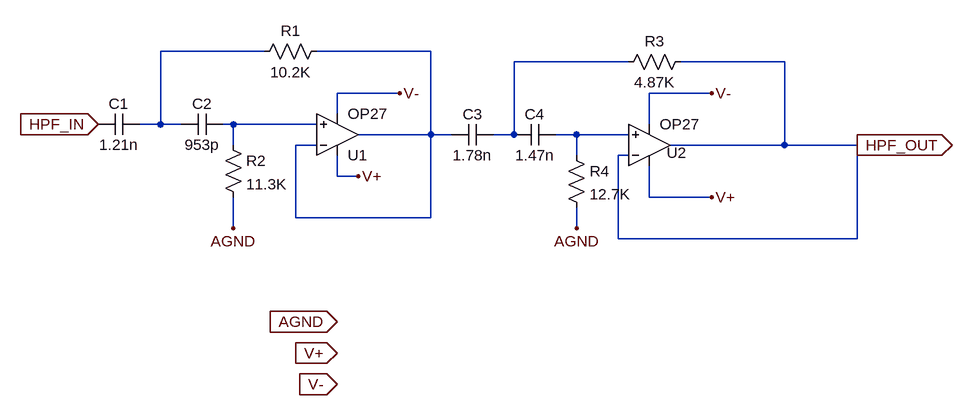
[diagram p0: schematic Acoustics_HPF.asc]
Acoustics_HPF.asc, the LTspice schematic file:
Version 4
SHEET 1 1304 788
WIRE 224 -32 64 -32
WIRE 480 -32 304 -32
WIRE 784 -16 608 -16
WIRE 1024 -16 864 -16
WIRE 432 32 336 32
WIRE 912 32 816 32
WIRE 336 64 336 32
WIRE 64 80 64 -32
WIRE 64 80 32 80
WIRE 96 80 64 80
WIRE 176 80 160 80
WIRE 304 80 176 80
WIRE 816 80 816 32
WIRE 480 96 480 -32
WIRE 480 96 368 96
WIRE 512 96 480 96
WIRE 608 96 608 -16
WIRE 608 96 576 96
WIRE 704 96 672 96
WIRE 784 96 704 96
WIRE 176 112 176 80
WIRE 304 112 272 112
WIRE 1024 112 1024 -16
WIRE 1024 112 848 112
WIRE 1136 112 1024 112
WIRE 704 128 704 96
WIRE 784 128 768 128
WIRE 336 160 336 128
WIRE 368 160 336 160
WIRE 816 192 816 144
WIRE 912 192 816 192
WIRE 272 224 272 112
WIRE 480 224 480 96
WIRE 480 224 272 224
WIRE 176 240 176 192
WIRE 704 240 704 208
WIRE 768 256 768 128
WIRE 1136 256 1136 112
WIRE 1136 256 768 256
FLAG 1136 112 HPF_OUT
IOPIN 1136 112 Out
FLAG 912 192 V+
FLAG 704 240 AGND
FLAG 176 240 AGND
FLAG 368 160 V+
FLAG 912 32 V-
FLAG 432 32 V-
FLAG -32 80 HPF_IN
IOPIN -32 80 In
FLAG 336 384 AGND
IOPIN 336 384 In
FLAG 336 432 V+
IOPIN 336 432 In
FLAG 336 480 V-
IOPIN 336 480 In
SYMBOL cap 32 64 R90
WINDOW 0 0 32 VBottom 2
WINDOW 3 32 32 VTop 2
SYMATTR InstName C1
SYMATTR Value 1.21n
SYMATTR SpiceLine V=6.3 Irms=30.8m Rser=3.04503 Lser=0 mfg="KEMET" pn="C0402C122K9RAC" type="X7R"
SYMBOL cap 96 96 R270
WINDOW 0 32 32 VTop 2
WINDOW 3 0 32 VBottom 2
SYMATTR InstName C2
SYMATTR Value 953p
SYMATTR SpiceLine V=25 Irms=0 Rser=0 Lser=0
SYMBOL res 320 -48 R90
WINDOW 0 0 56 VBottom 2
WINDOW 3 32 56 VTop 2
SYMATTR InstName R1
SYMATTR Value 10.2K
SYMATTR SpiceLine tol=1 pwr=0.1
SYMBOL Opamps\\OP27 336 160 M180
SYMATTR InstName U1
SYMBOL res 160 96 R0
SYMATTR InstName R2
SYMATTR Value 11.3K
SYMATTR SpiceLine tol=1 pwr=0.1
SYMBOL cap 576 80 R90
WINDOW 0 0 32 VBottom 2
WINDOW 3 32 32 VTop 2
SYMATTR InstName C3
SYMATTR Value 1.78n
SYMATTR SpiceLine V=6.3 Irms=46m Rser=2.21949 Lser=0
SYMBOL cap 672 80 R90
WINDOW 0 0 32 VBottom 2
WINDOW 3 32 32 VTop 2
SYMATTR InstName C4
SYMATTR Value 1.47n
SYMATTR SpiceLine V=6.3 Irms=38.4m Rser=2.57238 Lser=0
SYMBOL Opamps\\OP27 816 176 M180
WINDOW 0 27 52 Left 2
SYMATTR InstName U2
SYMBOL res 880 -32 R90
WINDOW 0 0 56 VBottom 2
WINDOW 3 32 56 VTop 2
SYMATTR InstName R3
SYMATTR Value 4.87K
SYMATTR SpiceLine tol=1 pwr=0.1
SYMBOL res 688 112 R0
SYMATTR InstName R4
SYMATTR Value 12.7K
SYMATTR SpiceLine tol=1 pwr=0.1

The netlist it stands for:
* Acoustics_HPF.asc
C1 N001 HPF_IN 1.21n V=6.3 Irms=30.8m Rser=3.04503 Lser=0 mfg="KEMET" pn="C0402C122K9RAC" type="X7R"
C2 N001 N004 953p V=25 Irms=0 Rser=0 Lser=0
R1 N002 N001 10.2K tol=1 pwr=0.1
XU1 N004 N002 V+ V- N002 OP27  ; pins In+ In- V+ V- OUT
R2 N004 AGND 11.3K tol=1 pwr=0.1
C3 N003 N002 1.78n V=6.3 Irms=46m Rser=2.21949 Lser=0
C4 N005 N003 1.47n V=6.3 Irms=38.4m Rser=2.57238 Lser=0
XU2 N005 HPF_OUT V+ V- HPF_OUT OP27  ; pins In+ In- V+ V- OUT
R3 HPF_OUT N003 4.87K tol=1 pwr=0.1
R4 N005 AGND 12.7K tol=1 pwr=0.1
.lib ADI.lib
.backanno
.end